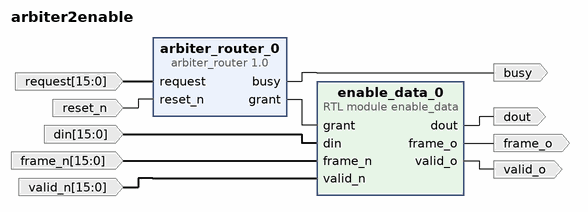
[diagram p0: block diagram of the top level]
# Vivado block design arbiter2enable, xc7z020clg484-1, Vivado 2024.1
create_bd_design arbiter2enable

create_bd_port -dir I -from 15 -to 0 frame_n
create_bd_port -dir I -from 15 -to 0 valid_n
create_bd_port -dir I -from 15 -to 0 din
create_bd_port -dir I -type rst reset_n
create_bd_port -dir I -from 15 -to 0 request
create_bd_port -dir O busy
create_bd_port -dir O frame_o
create_bd_port -dir O valid_o
create_bd_port -dir O dout

create_bd_cell -type module -reference enable_data enable_data_0
create_bd_cell -type ip -vlnv xilinx.com:user:arbiter_router:1.0 arbiter_router_0

# ---- connections ----

connect_bd_net [get_bd_pins arbiter_router_0/busy] [get_bd_ports busy]
connect_bd_net [get_bd_pins arbiter_router_0/grant] [get_bd_pins enable_data_0/grant]
connect_bd_net [get_bd_ports din] [get_bd_pins enable_data_0/din]
connect_bd_net [get_bd_pins enable_data_0/dout] [get_bd_ports dout]
connect_bd_net [get_bd_pins enable_data_0/frame_o] [get_bd_ports frame_o]
connect_bd_net [get_bd_pins enable_data_0/valid_o] [get_bd_ports valid_o]
connect_bd_net [get_bd_ports frame_n] [get_bd_pins enable_data_0/frame_n]
connect_bd_net [get_bd_ports request] [get_bd_pins arbiter_router_0/request]
connect_bd_net [get_bd_ports reset_n] [get_bd_pins arbiter_router_0/reset_n]
connect_bd_net [get_bd_ports valid_n] [get_bd_pins enable_data_0/valid_n]

validate_bd_design
save_bd_design
